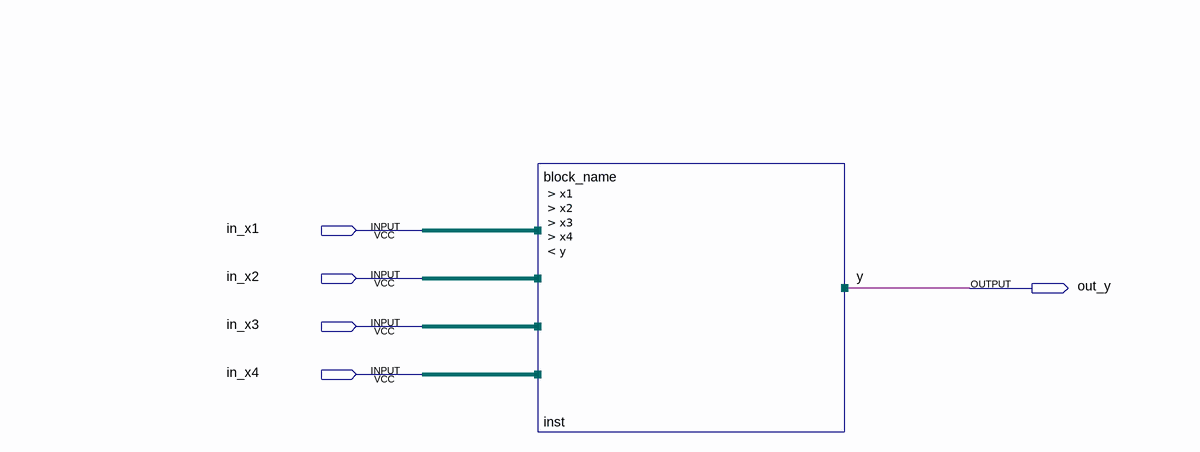
[diagram p0: schematic sheet]
// Quartus schematic Lab6_Naumchuk_IO-05.bdf as structural Verilog: 1 symbols, 5 pins
module \Lab6_Naumchuk_IO-05  (
  input  in_x1,
  input  in_x2,
  input  in_x3,
  input  in_x4,
  output out_y
);

  block_name inst (.x1(in_x1), .x2(in_x2), .x3(in_x3), .x4(in_x4), .y(out_y));

  // Other names for the same wires on the sheet: y = out_y
endmodule
